# EAGLE design Algyan-5th-01 (EAGLE 9.5.2)
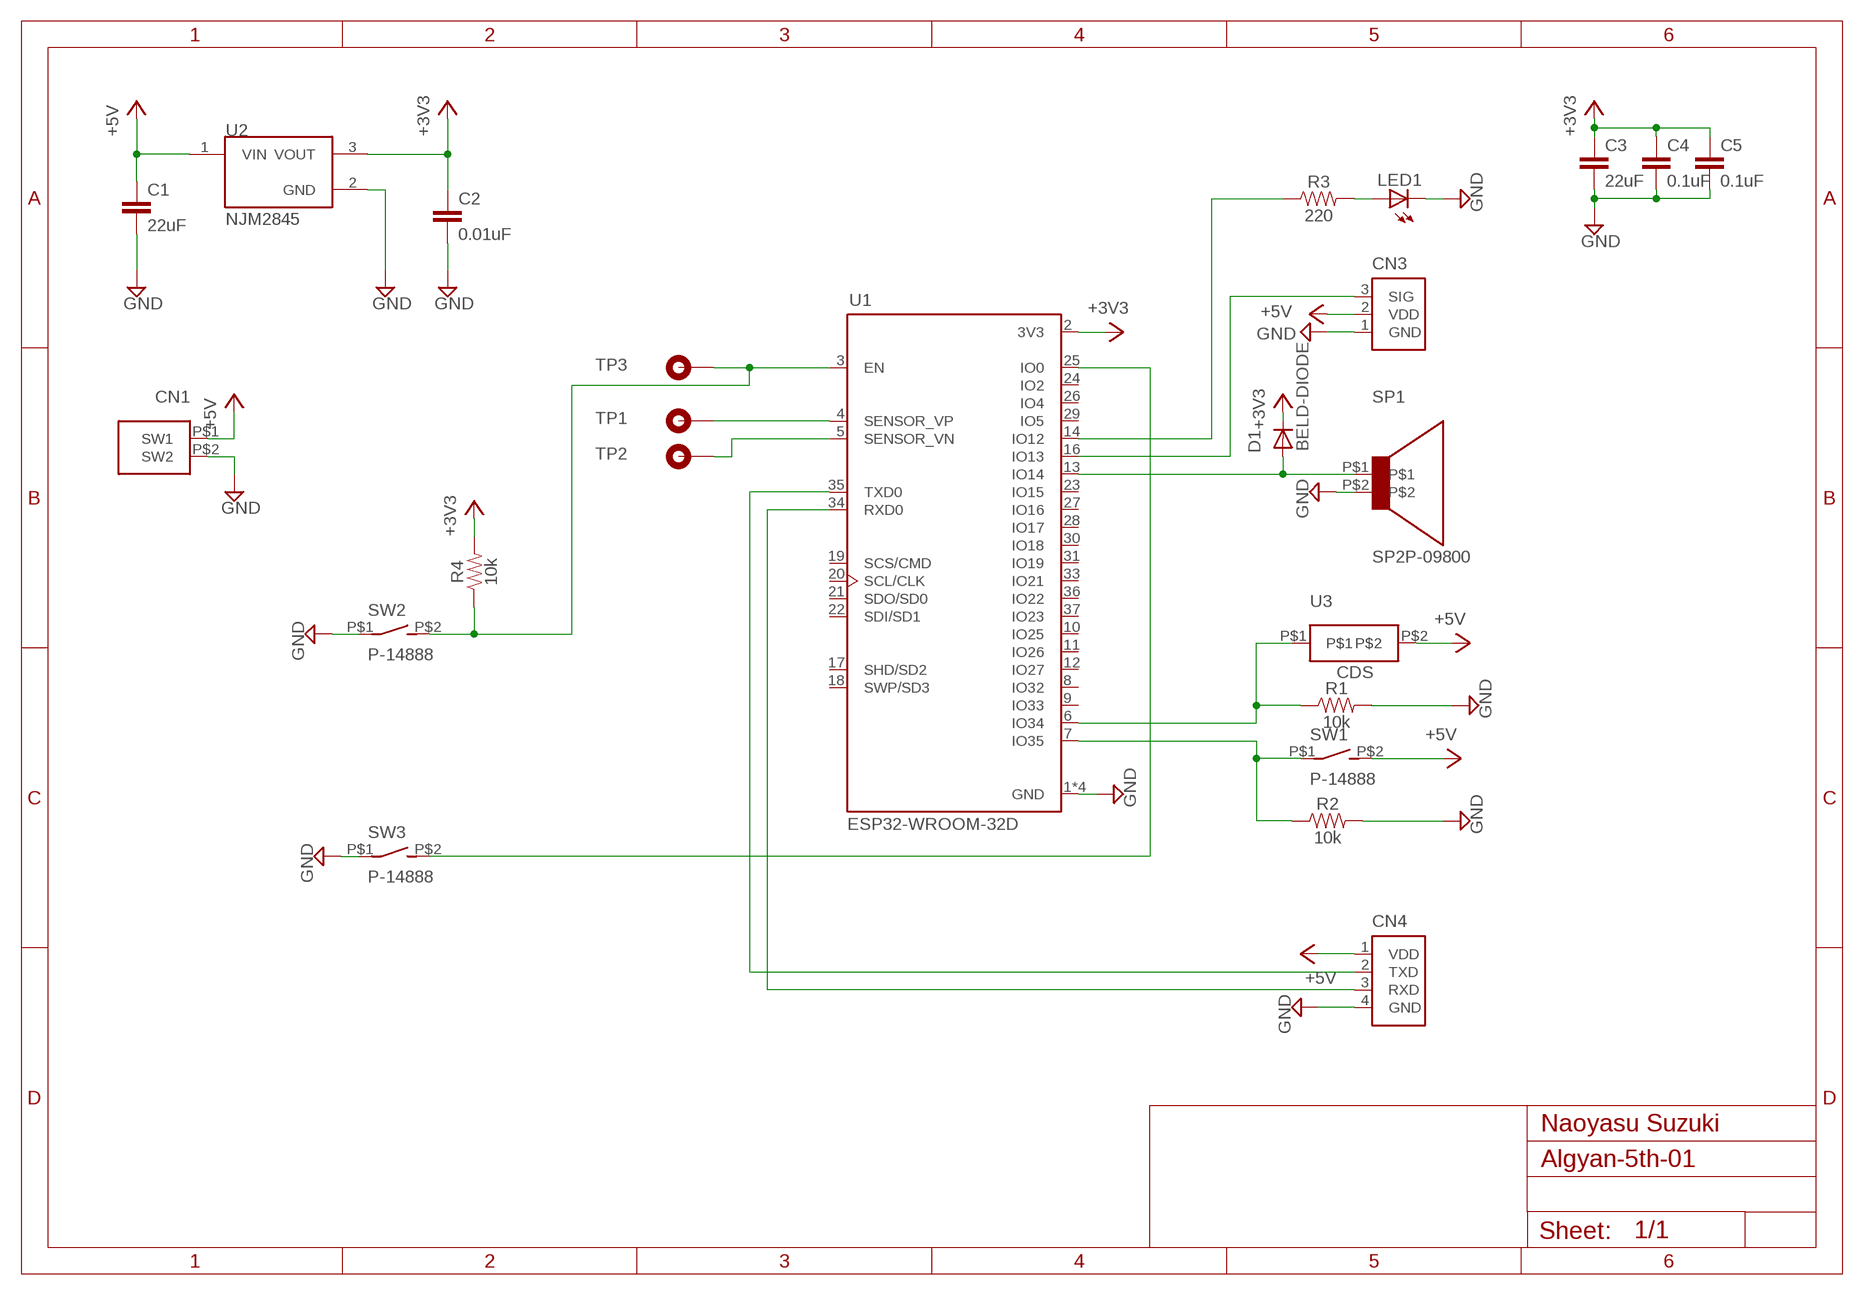
[diagram p0: schematic, sheet 1]

## Parts
C1  22uF  22UF-1210-16V-20%  [1210]
C2  0.01uF  BELD-0.01UF  [0603]
C3  22uF  22UF-1210-16V-20%  [1210]
C4  0.1uF  0.1UF-0603-25V-(+80/-20%)  [0603]
C5  0.1uF  0.1UF-0603-25V-(+80/-20%)  [0603]
CN1  SW－WP  [SP2]
CN3  MIL3  [ML3]
CN4  ESP-UART  [ML4]
D1  BELD-DIODE  [DB2S40600L]
LED1  LED3216  [3216]
R1  10k  10KOHM-0603-1/10W-1%  [0603]
R2  10k  10KOHM-0603-1/10W-1%  [0603]
R3  220  220OHM-0603-1/10W-1%  [0603]
R4  10k  10KOHM-0603-1/10W-1%  [0603]
SP1  SP2P-09800  [P-09800]
SW1  P-14888  [P-14888]
SW2  P-14888  [P-14888]
SW3  P-14888  [P-14888]
TP1  TPHOLE  [TP-HOLE]
TP2  TPHOLE  [TP-HOLE]
TP3  TPHOLE  [TP-HOLE]
U1  ESP32-WROOM-32D  [MODULE_ESP32-WROOM-32D]
U2  NJM2845  I-02247_NJM2845  [TO252]
U3  CDS  [CDS]

## Nets
+3V3: C2.1 C3.1 C4.1 C5.1 D1.P$1(K) R4.2 U1.2(3V3) U2.3(VOUT)
+5V: C1.1 CN1.P$1(SW1) CN3.2(VDD) CN4.1(VDD) SW1.P$2(S) U2.1(VIN) U3.P$2
GND: C1.2 C2.2 C3.2 C4.2 C5.2 CN1.P$2(SW2) CN3.1(GND) CN4.4(GND) LED1.P$1(C) R1.2 R2.2 SP1.P$2 SW2.P$1(P) SW3.P$1(P) U1.1(GND) U1.15(GND) U1.38(GND) U1.39(GND) U2.2(GND)
N$1: R1.1 U1.6(IO34) U3.P$1
N$2: CN3.3(SIG) U1.16(IO13)
N$3: R2.1 SW1.P$1(P) U1.7(IO35)
N$4: D1.P$2(A) SP1.P$1 U1.13(IO14)
N$5: R4.1 SW2.P$2(S) TP3.1 U1.3(EN)
N$6: TP1.1 U1.4(SENSOR_VP)
N$7: TP2.1 U1.5(SENSOR_VN)
N$8: CN4.2(TXD) U1.35(TXD0)
N$9: CN4.3(RXD) U1.34(RXD0)
N$10: R3.1 U1.14(IO12)
N$11: LED1.P$2(A) R3.2
N$13: SW3.P$2(S) U1.25(IO0)
Unconnected: U1.8(IO32) U1.9(IO33) U1.10(IO25) U1.11(IO26) U1.12(IO27) U1.17(SHD/SD2) U1.18(SWP/SD3) U1.19(SCS/CMD) U1.20(SCL/CLK) U1.21(SDO/SD0) U1.22(SDI/SD1) U1.23(IO15) U1.24(IO2) U1.26(IO4) U1.27(IO16) U1.28(IO17) U1.29(IO5) U1.30(IO18) U1.31(IO19) U1.33(IO21) U1.36(IO22) U1.37(IO23)

## Notes on the sheet
- Naoyasu Suzuki

## Library data of the parts
C1 C3 = Beld-Capaciters:22UF: 22µF ceramic capacitors A capacitor is a passive two-terminal electrical component used to store electrical energy temporarily in an electric field.
C2 = Beld-Capaciters:BELD-0.01UF: 0.1µF ceramic capacitors A capacitor is a passive two-terminal electrical component used to store electrical energy temporarily in an electric field.
C4 C5 = Beld-Capaciters:0.1UF: 0.1µF ceramic capacitors A capacitor is a passive two-terminal electrical component used to store electrical energy temporarily in an electric field.; PROD_ID: CAP-00810
CN1 = Beld-CONSWETC:SW－WP
CN3 = Beld-CONSWETC:MIL3
CN4 = Beld-CONSWETC:ESP-UART
D1 = Beld-CONSWETC:BELD-DIODE: Capacity DIODE variable-capacitance diode
LED1 = Beld-CONSWETC 3:LED
R1 R2 R4 = Beld-Resistors:10KOHM: 10kΩ resistor A resistor is a passive two-terminal electrical component that implements electrical resistance as a circuit element. Resistors act to reduce current flow, and, at the same time, act to lower voltage levels within circuits. - Wikipedia; PROD_ID: RES-00824
R3 = Beld-Resistors:220OHM: 220Ω resistor A resistor is a passive two-terminal electrical component that implements electrical resistance as a circuit element. Resistors act to reduce current flow, and, at the same time, act to lower voltage levels within circuits. - Wikipedia; PROD_ID: RES-07861
SP1 = Beld-CONSWETC 3:SP2
SW1-SW3 = Beld-CONSWETC:P-14888
TP1-TP3 = Beld-CONSWETC:TP
U1 = Beld-IC:ESP32-WROOM-32D: IC: SoC; GPIO, I2C, I2S, IR, SD, SDIO, SPI, UART; 2.7÷3.6VDC; 20dBm; DESCRIPTION: Bluetooth, WiFi 802.11b/g/n, Bluetooth v4.2 + EDR, Class 1, 2 and 3 Transceiver Module 2.4GHz ~ 2.5GHz Integrated, Trace Surface Mount; DIGI-KEY_PART_NUMBER: 1904-1023-1-ND; DIGI-KEY_PURCHASE_URL: https://www.digikey.com/product-detail/en/espressif-systems/ESP32-WROOM-32D/1904-1023-1-ND/9381732?utm_source=snapeda&utm_medium=aggregator&utm_campaign=symbol; MF: Espressif Systems; MP: ESP32-WROOM-32D; PACKAGE: Module Espressif Systems
U2 = AKIDUKI:I-02247_NJM2845
U3 = Beld-IC:CDS

## Board
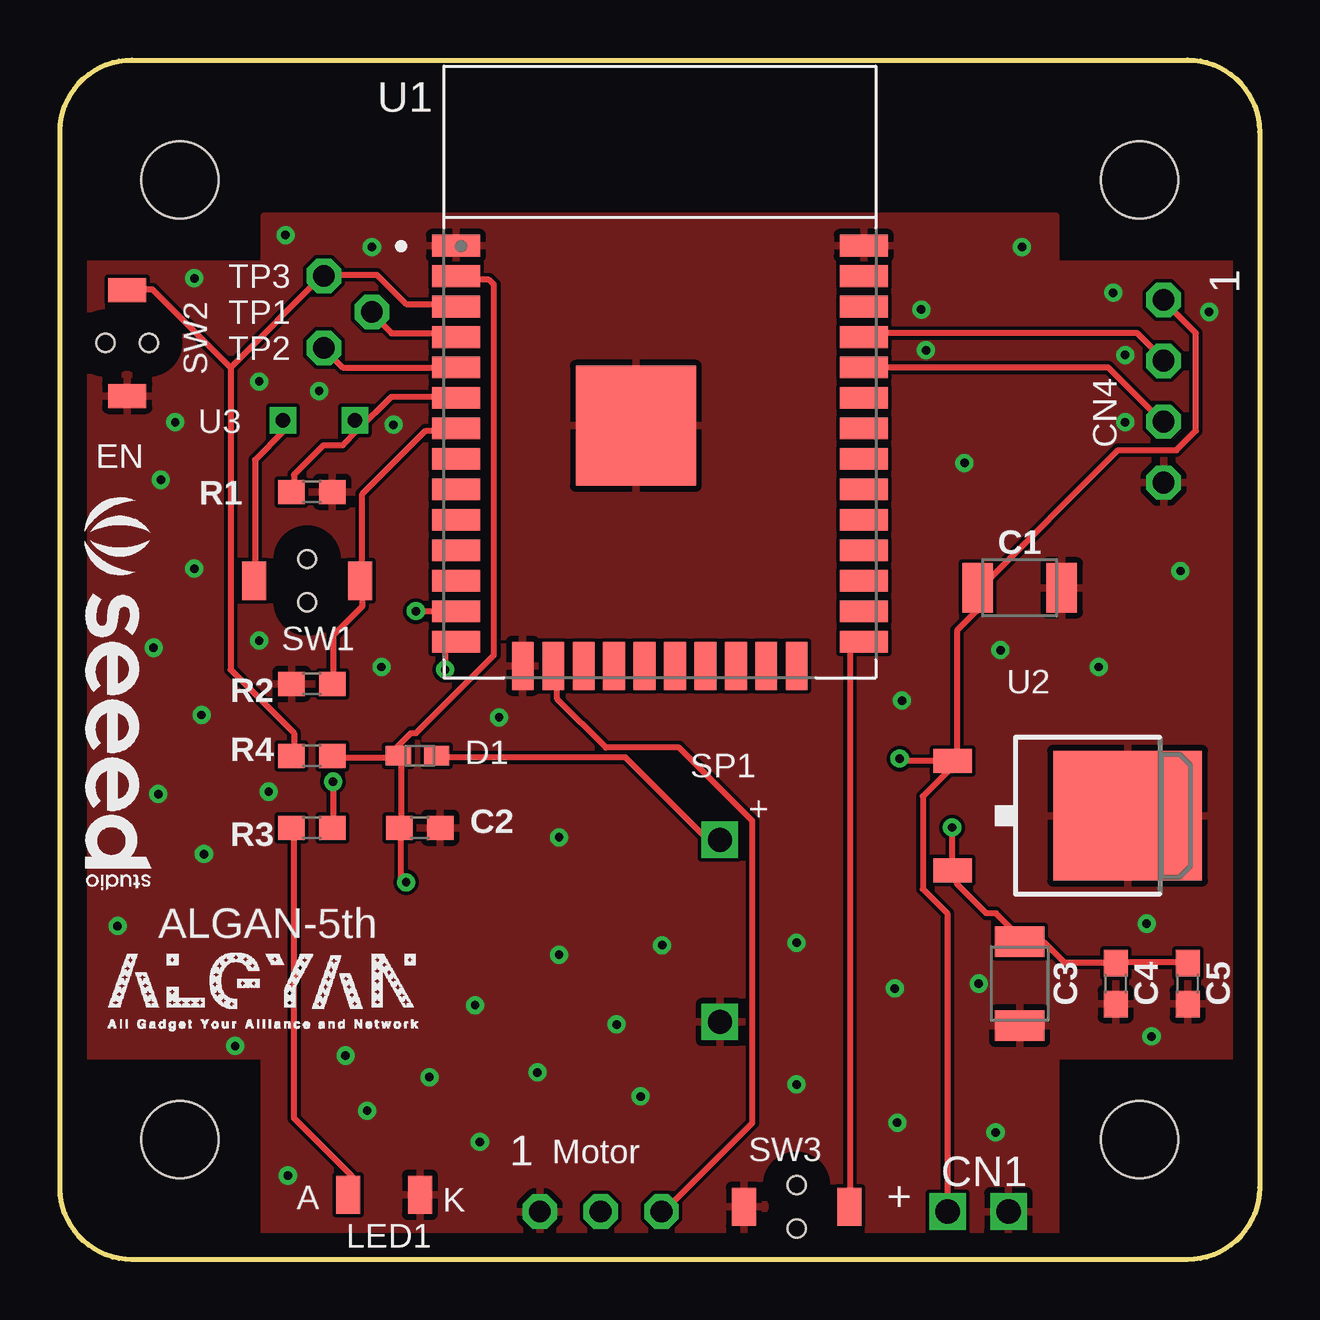
[diagram p1: board, top side]
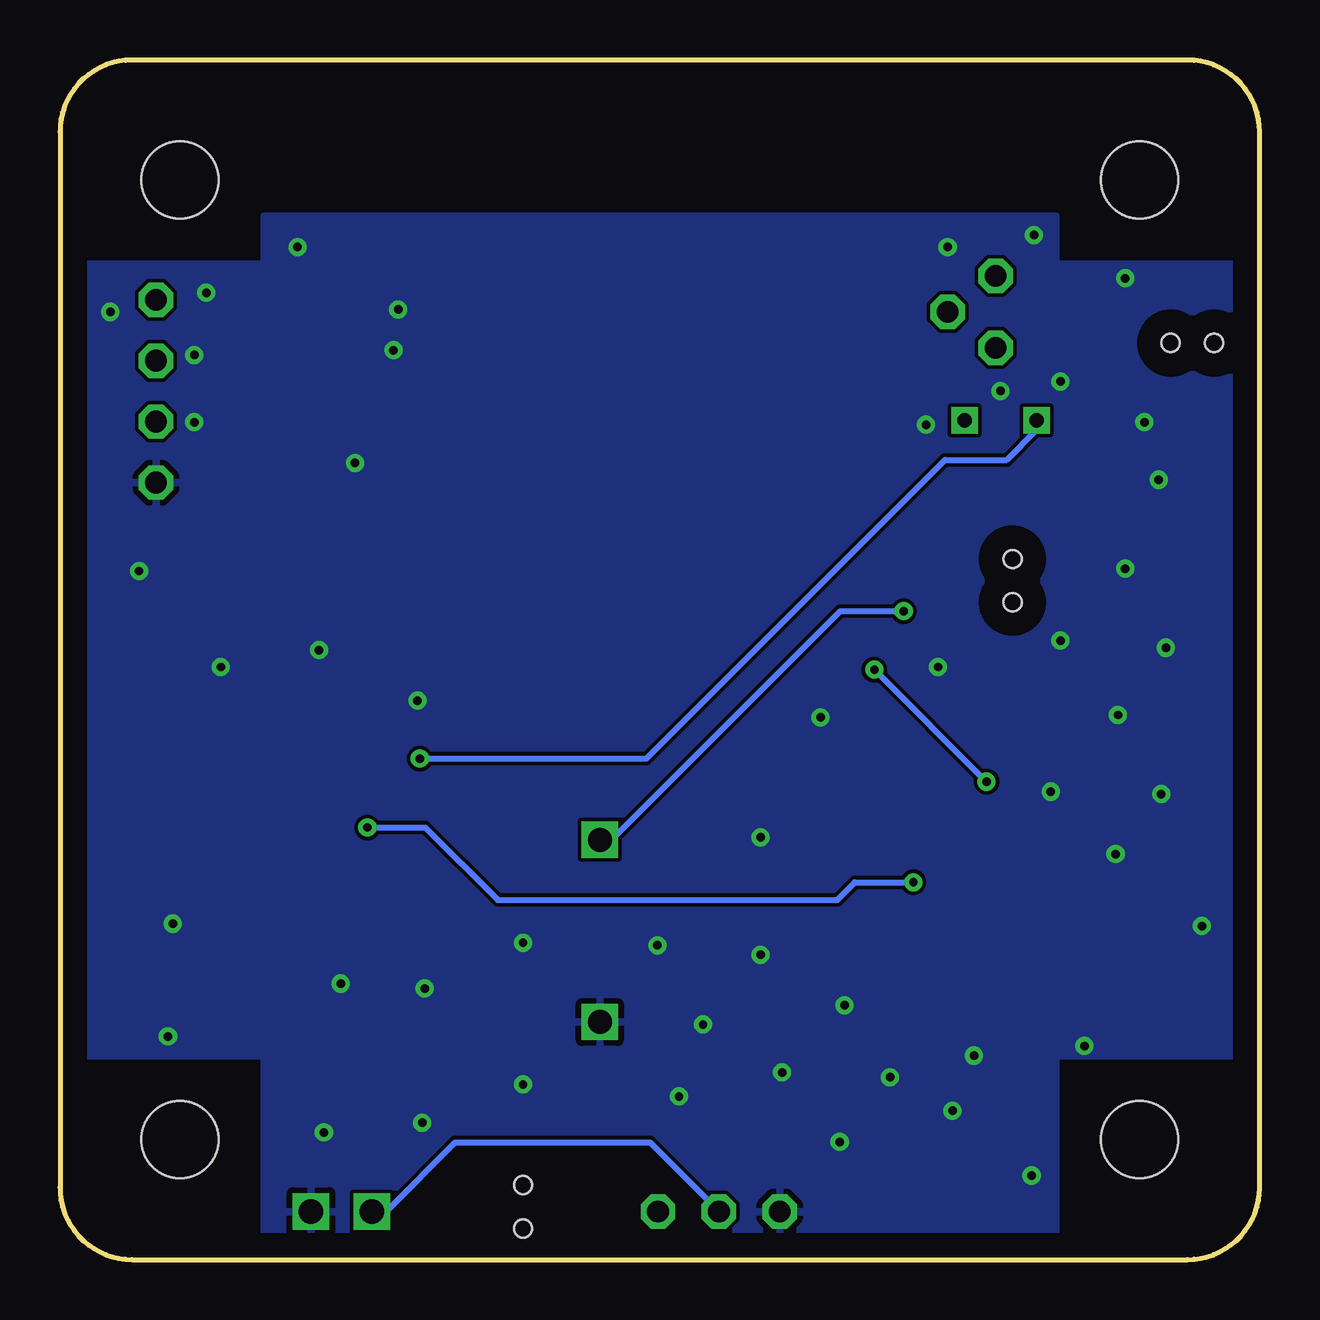
[diagram p2: board, bottom side, seen from below]

Size 50 x 50 mm. Coordinates in mm from the lower left corner, seen from the top.
Outline: 0,3 0,47 arc-90 3,50 47,50 arc-90 50,47 50,3 arc-90 47,0 3,0 arc-90 0,3
Copper layers (1*16): Top 0.035mm / dielectric 1.5mm / Bottom 0.035mm
Design rules "default *": minimum track width 10mil, minimum drill 0.35mm, track to track 6mil, track to pad 6mil, pad to pad 6mil, via to via 6mil, smd to smd 6mil, copper to edge 40mil, drill to drill 6mil, minimum pad ring 10mil, minimum via ring 8mil, stop-mask expansion 4mil, vias tented up to drill 0.4mm, thermal gap 10mil
Holes 3.2 mm at 5,5 5,45 45,45 45,5

### Footprints (pad centres in the part's own frame; a part is rotated, then mirrored left to right if it is on the bottom)
1210 = smd 1.27 x 2.06: 1 -1.755,0; 2 1.755,0
0603 = smd 1.1 x 1: 1 -0.85,0; 2 0.85,0
SP2 = drill 1.016 square: P$1 0,0; P$2 2.54,0
ML3 = drill 0.914 octagon: 1 0,0; 2 2.54,0; 3 5.08,0
ML4 = drill 0.914 octagon: 1 0,0; 2 2.54,0; 3 5.08,0; 4 7.62,0
DB2S40600L = smd 1.05 x 0.8: P$1 -0.9,0; P$2 0.7,0
3216 = smd 1 x 1.6: P$1 -0.5,0.8; P$2 2.5,0.8
P-09800 = drill 1 square: P$1 0,0; P$2 7.6,0
P-14888 = smd 1.6 x 1: P$1 0.8,0.5; P$2 0.8,4.9 | hole 0.75: -0.1,2.7; 1.7,2.7
TP-HOLE = drill 0.914 octagon: 1 0,0
MODULE_ESP32-WROOM-32D = smd 2 x 0.9: 1 -8.5,5.26; 2 -8.5,3.99; 3 -8.5,2.72; 4 -8.5,1.45; 5 -8.5,0.18; 6 -8.5,-1.09; 7 -8.5,-2.36; 8 -8.5,-3.63; 9 -8.5,-4.9; 10 -8.5,-6.17; 11 -8.5,-7.44; 12 -8.5,-8.71; 13 -8.5,-9.98; 14 -8.5,-11.25; 25 8.5,-11.25; 26 8.5,-9.98; 27 8.5,-8.71; 28 8.5,-7.44; 29 8.5,-6.17; 30 8.5,-4.9; 31 8.5,-3.63; 32 8.5,-2.36; 33 8.5,-1.09; 34 8.5,0.18; 35 8.5,1.45; 36 8.5,2.72; 37 8.5,3.99; 38 8.5,5.26 | smd 0.9 x 2: 15 -5.715,-12.25; 16 -4.445,-12.25; 17 -3.175,-12.25; 18 -1.905,-12.25; 19 -0.635,-12.25; 20 0.635,-12.25; 21 1.905,-12.25; 22 3.175,-12.25; 23 4.445,-12.25; 24 5.715,-12.25 | smd 5 x 5: 39 -1,-2.24
TO252 = smd 1 x 1.6: 1 -2.28,-4.8; 3 2.28,-4.8 | smd 5.4 x 6.2: 2 0,2.5
CDS = drill 0.6 square: P$1 0,0; P$2 3,0

### Placement (x,y rotation side)
C1  40,28 0 top
C2  15,18 0 top
C3  40,11.5 270 top
C4  44,11.5 270 top
C5  47,11.5 270 top
CN1  37,2 0 top
CN3  20,2 0 top
CN4  46,40 270 top
D1  15,21 0 top
LED1  14.5,3.5 180 top
R1  10.5,32 0 top
R2  10.5,24 180 top
R3  10.5,18 180 top
R4  10.5,21 0 top
SP1  27.5,17.5 270 top
SW1  13,27.5 90 top
SW2  2,35.5 0 top
SW3  28,3 270 top
TP1  13,39.5 0 top
TP2  11,38 0 top
TP3  11,41 0 top
U1  25,37 0 top
U2  42,18.5 270 top
U3  12.3,34.98 180 top

### Tracks (layer width: path | path; a pad name or v marks a point on that pad's centre or on a via)
+3V3  (via drill 0.35)
  Top 0.254: C5.1 46.94,12.39 44.09,12.39 C4.1 43.89,12.39 41.86,12.39 41.05,13.21 40.03,13.21 C3.1 40.03,13.41 39.01,14.43 38.61,14.43 37.39,15.65 37.39,16.05 U2.3 37.2,17.99 v37.19,18.01 | 13.61,20.93 11.38,20.93 R4.2 | 13.61,20.93 14.02,20.93 D1.P$1 | 14.22,18.09 14.22,20.93 D1.P$1 | 14.22,18.09 C2.1 | 13.61,20.93 14.63,21.95 14.83,21.95 18.09,25.2 18.09,40.64 17.88,40.84 16.66,40.84 U1.2 | 13.61,20.93 D1.P$1 | v14.43,15.72 14.22,15.93 14.22,18.09
  Bottom 0.254: v37.19,18.01 34.77,18.01 31.75,14.99 17.6,14.99 16.87,15.72 v14.43,15.72
+5V  (via drill 0.35)
  Top 0.254: SW1.P$2 8.13,28.45 8.13,33.33 9.35,34.54 9.35,34.95 U3.P$2 | U2.1 37.39,20.93 37.39,26.21 38.2,27.03 38.2,27.84 C1.1 38.41,28.04 44.09,33.73 46.53,33.73 47.35,34.54 47.35,38.61 46.13,39.83 CN4.1 | CN1.P$1 36.98,2.03 36.98,14.43 35.97,15.44 35.97,19.3 37.39,20.73 U2.1 | U2.1 35.1,20.78 v35,20.88
  Bottom 0.254: CN3.2 22.55,2.03 25.4,4.88 33.53,4.88 36.37,2.03 36.98,2.03 CN1.P$1 | v35,20.88 25.55,20.88 13.11,33.33 10.54,33.33 9.29,34.57 U3.P$2
GND  (via drill 0.35)
  other vias: 20.8,17.6 34.8,11.3 37.7,33.2 36.1,37.9 18.3,22.6 13.4,24.7 8.3,25.8 13.9,34.8 10.8,36.2 8.3,36.6 4.2,32.5 5.6,28.8 3.9,25.5 5.9,22.7 4.1,19.4 8.7,19.5 6,16.9 2.4,13.9 7.3,8.9 9.5,3.5 12.8,6.2 11.9,8.5 15.4,7.6 17.5,4.9 19.9,7.8 17.3,10.6 20.8,12.7 23.2,9.8 24.2,6.8 25.1,13.1 30.7,13.2 30.7,7.3 34.9,5.7 39,5.3 38.3,11.5 45.5,9.3 45.3,14 43.3,24.7 46.7,28.7 39.2,25.4 35.1,23.3 44.4,34.9 44.4,37.7 43.9,40.3 47.9,39.5 35.9,39.6 40.1,42.2 13,42.2 9.4,42.7 5.6,40.9 4.8,34.9
  pour Top: 8.5,0.5 8.5,8.5 0.5,8.5 0.5,41.5 8.5,41.5 8.5,43.5 41.5,43.5 41.5,41.5 49.5,41.5 49.5,8.5 41.5,8.5 41.5,0.5
  pour Bottom: 0.5,8.5 0.5,41.5 8.5,41.5 8.5,43.5 41.5,43.5 41.5,41.5 49.5,41.5 49.5,8.5 41.5,8.5 41.5,0.5 8.5,0.5 8.5,8.5
N$1
  Top 0.254: 12.39,34.54 11.79,33.93 10.97,33.93 9.75,32.72 9.75,32.11 R1.1 | 12.39,34.54 12.39,34.95 U3.P$1 12.39,34.54 | 12.39,34.54 13.82,35.97 16.46,35.97 U1.6
N$2
  Top 0.254: U1.16 20.73,24.59 20.73,23.37 22.76,21.34 25.81,21.34 28.85,18.29 28.85,5.69 25.2,2.03 CN3.3
N$3
  Top 0.254: R2.1 11.38,24.18 11.38,26.01 12.6,27.23 12.6,28.25 SW1.P$1 12.6,28.45 12.6,31.9 15.24,34.54 16.46,34.54 U1.7
N$4  (via drill 0.35)
  Top 0.254: D1.P$2 15.85,20.93 23.57,20.93 26.82,17.68 27.43,17.68 SP1.P$1 | v14.83,27.03 16.46,27.03 U1.13
  Bottom 0.254: v14.83,27.03 17.48,27.03 26.82,17.68 27.43,17.68 SP1.P$1
N$5
  Top 0.254: 7.11,37.19 7.11,24.59 9.75,21.95 9.75,21.13 R4.1 | 7.11,37.19 10.97,41.05 TP3.1 11.18,41.05 13.21,41.05 14.43,39.83 16.46,39.83 U1.3 | 7.11,37.19 3.86,40.44 2.85,40.44 SW2.P$2
N$6
  Top 0.254: U1.4 16.46,38.61 13.82,38.61 13.01,39.42 TP1.1
N$7
  Top 0.254: U1.5 16.46,37.19 11.79,37.19 10.97,38 TP2.1
N$8
  Top 0.254: U1.35 33.53,38.61 44.91,38.61 45.92,37.59 CN4.2
N$9
  Top 0.254: U1.34 33.53,37.19 43.69,37.19 45.92,34.95 CN4.3
N$10  (via drill 0.35)
  Top 0.254: v11.38,19.91 11.38,18.09 R3.1 | v16.05,24.59 16.05,25.4 16.46,25.81 U1.14
  Bottom 0.254: v16.05,24.59 v11.38,19.91
N$11
  Top 0.254: R3.2 9.75,17.88 9.75,5.89 12.19,3.45 12.19,2.85 LED1.P$2
N$13
  Top 0.254: SW3.P$2 32.92,2.23 32.92,25.4 33.33,25.81 U1.25

### Text on the board
tPlace: EN | ALGAN-5th | Motor